# Altium schematic sheet LBF Op-Amp Gain.SchDoc
size A
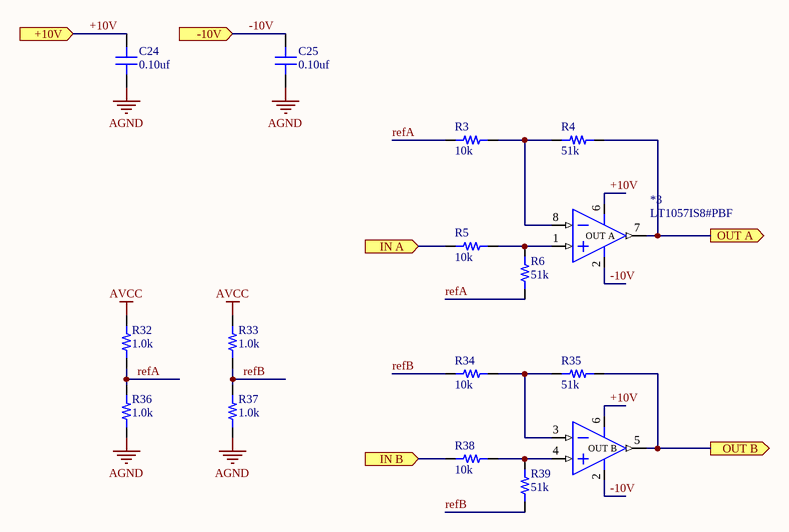
[diagram p0: LBF Op-Amp Gain.SchDoc]

## Parts
*3  LT1057IS8#PBF  [SOIC-8]
C24  value 0.10uf  [CAP 0805/2012]  (hidden comment: Capacitor MLCC 0.10uf 25V CAP 0805/2012)
C25  value 0.10uf  [CAP 0805/2012]  (hidden comment: Capacitor MLCC 0.10uf 25V CAP 0805/2012)
R3  value 10k  [RES 0805/2012]  (hidden comment: Resistor 10k 0805 1/10W 1%)
R4  value 51k  [RES 0805/2012]  (hidden comment: Resistor 51k 0805 1/10W 1%)
R5  value 10k  [RES 0805/2012]  (hidden comment: Resistor 10k 0805 1/10W 1%)
R6  value 51k  [RES 0805/2012]  (hidden comment: Resistor 51k 0805 1/10W 1%)
R32  value 1.0k  [RES 0805/2012]  (hidden comment: Resistor 1.0k 0805 1/10W 1%)
R33  value 1.0k  [RES 0805/2012]  (hidden comment: Resistor 1.0k 0805 1/10W 1%)
R34  value 10k  [RES 0805/2012]  (hidden comment: Resistor 10k 0805 1/10W 1%)
R35  value 51k  [RES 0805/2012]  (hidden comment: Resistor 51k 0805 1/10W 1%)
R36  value 1.0k  [RES 0805/2012]  (hidden comment: Resistor 1.0k 0805 1/10W 1%)
R37  value 1.0k  [RES 0805/2012]  (hidden comment: Resistor 1.0k 0805 1/10W 1%)
R38  value 10k  [RES 0805/2012]  (hidden comment: Resistor 10k 0805 1/10W 1%)
R39  value 51k  [RES 0805/2012]  (hidden comment: Resistor 51k 0805 1/10W 1%)

## Ports
+10V (in), -10V (in), IN A (in), IN B (in), OUT A (out), OUT B (out)

## Nets
AGND: C24.1 C25.1 R36.1 R37.1
AVCC: R32.2 R33.2
+10V: *3.6(+Vcc) C24.2 ; port +10V
-10V: *3.2(-Vcc) C25.2 ; port -10V
IN A: R5.1 ; port IN A
IN B: R38.1 ; port IN B
OUT A: *3.7(OUT_A) R4.2 ; port OUT A
OUT B: *3.5(OUT_B) R35.2 ; port OUT B
refA: R3.1 R6.2 R32.1 R36.2
refB: R33.1 R34.1 R37.2 R39.2
Net*3_1: *3.1(+IN_A) R5.2 R6.1
Net*3_3: *3.3(+IN_B) R34.2 R35.1
Net*3_4: *3.4(+IN_B) R38.2 R39.1
Net*3_8: *3.8(-IN_A) R3.2 R4.1

## Library data of the parts
*3 = 1: IC OPAMP JFET 5MHZ 8SO; idOp_Amp: 1; Num_Circuits: 2; Slew_Rate: 13 V/us; Supply_Voltage: 10~18; Created_By: Albert Panuco; Manufacturer_id: 1; Drawer_id: 1; Name: OPAMP JFET; Amplifier_Type: JFET; GBW: 5MHz; Package: 8-SO; MfrPartNo: LT1057IS8#PBF; Link: https://www.digikey.com/product-detail/en/linear-technology-analog-devices/LT1057IS8-PBF/LT1057IS8-PBF-ND/961410; Supplier1: Digikey; Supplier1PartNo: LT1057IS8#PBF-ND
C24 C25 = 703: Manufacturer_id: 1; idCapacitor: 703; Name: Cap_0.10uf_25V_CAP 0805/2012; Dielectric: Ceramic; Created_By: Nick Mah; Drawer_id: 1; Voltage_Rating: 25V; Package: CAP 0805/2012; Created_Date: 10/20/2018
R3 R5 R34 R38 = 529: Manufacturer_id: 1; idResistor: 529; Name: Res_10k_0805_1/10W_1%; Created_By: Nick Mah; Supplier 1: Digi-Key; Drawer_id: 1; Tolerance: 1%; Power: 1/10W; Package: 0805; ComponentLink1Description: Datasheet; Created_Date: 2018-10-20
R4 R6 R35 R39 = 546: Manufacturer_id: 1; idResistor: 546; Name: Res_51k_0805_1/10W_1%; Created_By: Nick Mah; Supplier 1: Digi-Key; Drawer_id: 1; Tolerance: 1%; Power: 1/10W; Package: 0805; ComponentLink1Description: Datasheet; Created_Date: 2018-10-20
R32 R33 R36 R37 = 505: Manufacturer_id: 1; idResistor: 505; Name: Res_1.0k_0805_1/10W_1%; Created_By: Nick Mah; Supplier 1: Digi-Key; Drawer_id: 1; Tolerance: 1%; Power: 1/10W; Package: 0805; ComponentLink1Description: Datasheet; Created_Date: 2018-10-20